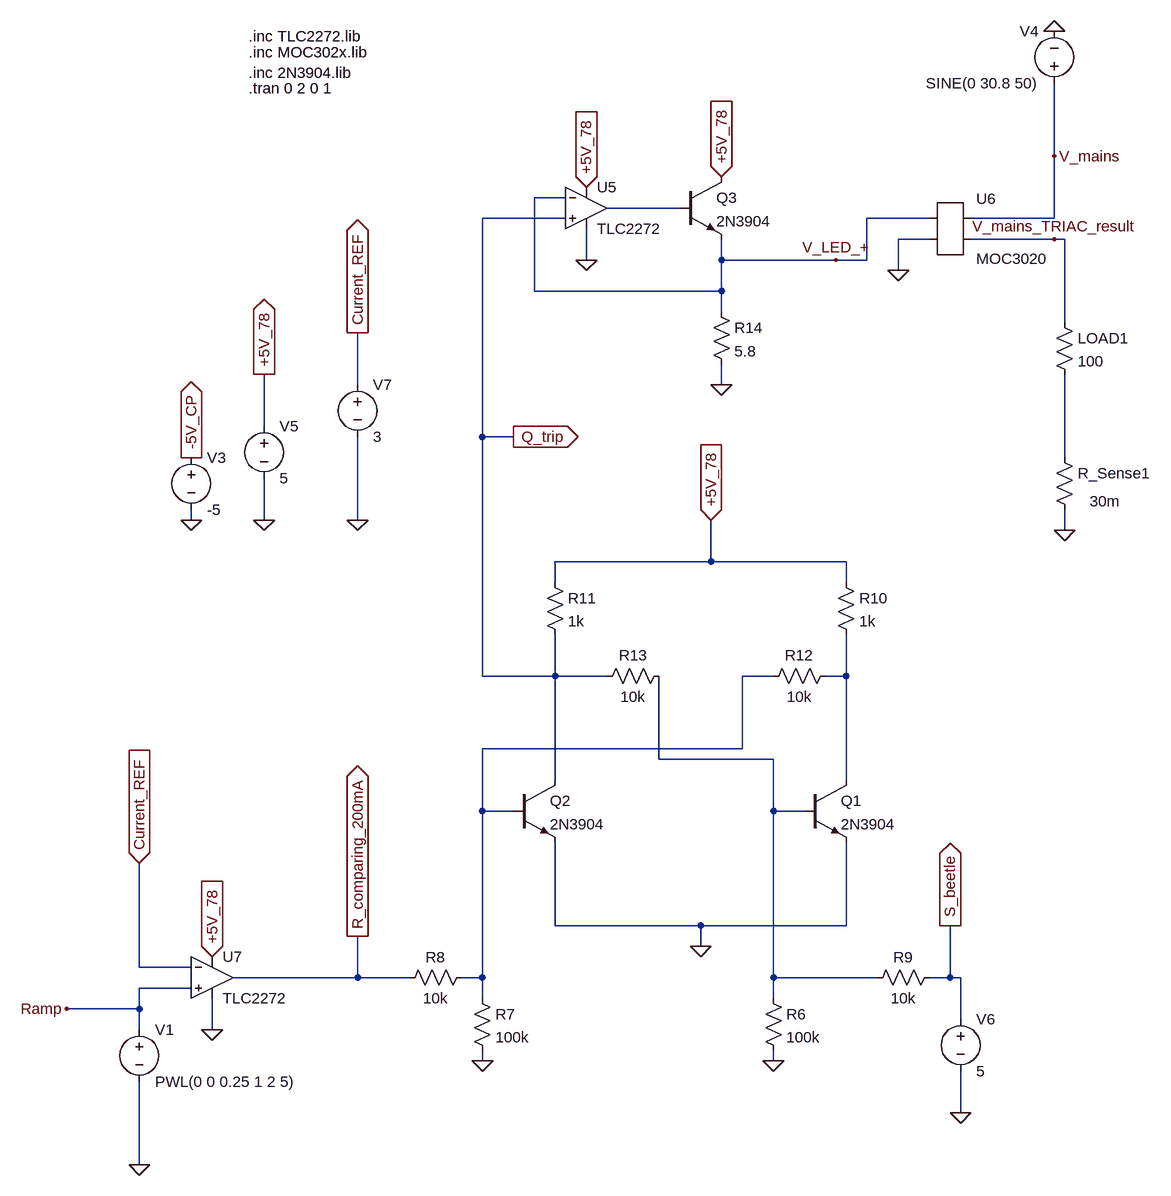
[diagram p0: schematic Dems.asc]
Dems.asc, the LTspice schematic file:
Version 4
SHEET 1 4420 4132
WIRE 1632 2560 1632 2448
WIRE 880 2624 832 2624
WIRE 1056 2640 944 2640
WIRE 880 2656 752 2656
WIRE 1440 2656 1344 2656
WIRE 1632 2656 1632 2560
WIRE 1632 2656 1504 2656
WIRE 1440 2688 1392 2688
WIRE 1632 2688 1504 2688
WIRE 1648 2688 1632 2688
WIRE 912 2720 912 2672
WIRE 1120 2720 1120 2688
WIRE 1296 2720 1120 2720
WIRE 1344 2720 1344 2656
WIRE 1344 2720 1296 2720
WIRE 1392 2736 1392 2688
WIRE 832 2768 832 2624
WIRE 1120 2768 1120 2720
WIRE 1120 2768 832 2768
WIRE 1120 2800 1120 2768
WIRE 1648 2816 1648 2688
WIRE 560 2912 560 2832
WIRE 1120 2912 1120 2880
WIRE 416 2976 416 2896
WIRE 752 2992 752 2656
WIRE 800 2992 752 2992
WIRE 1648 3024 1648 2896
WIRE 304 3120 304 3104
WIRE 416 3120 416 3056
WIRE 560 3120 560 2992
WIRE 1648 3136 1648 3104
WIRE 1104 3184 1104 3120
WIRE 1104 3184 864 3184
WIRE 1312 3184 1104 3184
WIRE 864 3216 864 3184
WIRE 1312 3216 1312 3184
WIRE 752 3360 752 2992
WIRE 864 3360 864 3296
WIRE 864 3360 752 3360
WIRE 944 3360 864 3360
WIRE 1200 3360 1152 3360
WIRE 1312 3360 1312 3296
WIRE 1312 3360 1280 3360
WIRE 1152 3472 1152 3360
WIRE 1152 3472 752 3472
WIRE 1024 3488 1024 3360
WIRE 1200 3488 1024 3488
WIRE 864 3520 864 3360
WIRE 1312 3520 1312 3360
WIRE 752 3568 752 3472
WIRE 800 3568 752 3568
WIRE 1200 3568 1200 3488
WIRE 1248 3568 1200 3568
WIRE 864 3744 864 3616
WIRE 1088 3744 864 3744
WIRE 1312 3744 1312 3616
WIRE 1312 3744 1088 3744
WIRE 1088 3776 1088 3744
WIRE 224 3808 224 3648
WIRE 304 3808 224 3808
WIRE 560 3824 560 3760
WIRE 560 3824 368 3824
WIRE 640 3824 560 3824
WIRE 752 3824 752 3568
WIRE 752 3824 720 3824
WIRE 1200 3824 1200 3568
WIRE 1360 3824 1200 3824
WIRE 1472 3824 1472 3744
WIRE 1472 3824 1440 3824
WIRE 1488 3824 1472 3824
WIRE 304 3840 224 3840
WIRE 752 3856 752 3824
WIRE 1200 3856 1200 3824
WIRE 224 3872 224 3840
WIRE 224 3872 112 3872
WIRE 1488 3888 1488 3824
WIRE 224 3904 224 3872
WIRE 336 3904 336 3856
WIRE 752 3952 752 3936
WIRE 1200 3952 1200 3936
WIRE 1488 4032 1488 3968
WIRE 224 4112 224 3984
FLAG 1648 3136 0
FLAG 304 3120 0
FLAG 304 3024 -5V_CP
IOPIN 304 3024 Out
FLAG 1632 2368 0
FLAG 1392 2736 0
FLAG 1088 3776 0
FLAG 752 3952 0
FLAG 1200 3952 0
FLAG 416 3120 0
FLAG 416 2896 +5V_78
IOPIN 416 2896 Out
FLAG 1104 3120 +5V_78
IOPIN 1104 3120 In
FLAG 1488 4032 0
FLAG 560 3760 R_comparing_200mA
IOPIN 560 3760 Out
FLAG 912 2608 +5V_78
IOPIN 912 2608 In
FLAG 912 2720 0
FLAG 1632 2560 V_mains
FLAG 1632 2688 V_mains_TRIAC_result
FLAG 1120 2592 +5V_78
IOPIN 1120 2592 In
FLAG 1120 2912 0
FLAG 560 3120 0
FLAG 560 2832 Current_REF
IOPIN 560 2832 Out
FLAG 336 3792 +5V_78
IOPIN 336 3792 In
FLAG 336 3904 0
FLAG 1296 2720 V_LED_+
FLAG 224 3648 Current_REF
IOPIN 224 3648 In
FLAG 1472 3744 S_beetle
IOPIN 1472 3744 Out
FLAG 224 4112 0
FLAG 800 2992 Q_trip
IOPIN 800 2992 Out
FLAG 112 3872 Ramp
SYMBOL res 1632 2800 R0
SYMATTR InstName LOAD1
SYMATTR Value 100
SYMBOL res 1632 3008 R0
WINDOW 3 55 83 Left 2
SYMATTR Value 30m
SYMATTR InstName R_Sense1
SYMBOL voltage 304 3008 R0
WINDOW 123 0 0 Left 2
WINDOW 39 0 0 Left 2
SYMATTR InstName V3
SYMATTR Value -5
SYMBOL voltage 1632 2464 R180
WINDOW 0 24 96 Left 2
WINDOW 3 24 16 Left 2
WINDOW 123 0 0 Left 0
WINDOW 39 0 0 Left 0
SYMATTR InstName V4
SYMATTR Value SINE(0 30.8 50)
SYMBOL npn 1248 3520 R0
SYMATTR InstName Q1
SYMATTR Value 2N3904
SYMBOL npn 800 3520 R0
SYMATTR InstName Q2
SYMATTR Value 2N3904
SYMBOL res 1184 3840 R0
SYMATTR InstName R6
SYMATTR Value 100k
SYMBOL res 736 3840 R0
SYMATTR InstName R7
SYMATTR Value 100k
SYMBOL res 736 3808 R90
WINDOW 0 0 56 VBottom 2
WINDOW 3 32 56 VTop 2
SYMATTR InstName R8
SYMATTR Value 10k
SYMBOL res 1456 3808 R90
WINDOW 0 0 56 VBottom 2
WINDOW 3 32 56 VTop 2
SYMATTR InstName R9
SYMATTR Value 10k
SYMBOL res 1296 3200 R0
SYMATTR InstName R10
SYMATTR Value 1k
SYMBOL res 848 3200 R0
SYMATTR InstName R11
SYMATTR Value 1k
SYMBOL res 1296 3344 R90
WINDOW 0 0 56 VBottom 2
WINDOW 3 32 56 VTop 2
SYMATTR InstName R12
SYMATTR Value 10k
SYMBOL res 1040 3344 R90
WINDOW 0 0 56 VBottom 2
WINDOW 3 32 56 VTop 2
SYMATTR InstName R13
SYMATTR Value 10k
SYMBOL voltage 416 2960 R0
WINDOW 123 0 0 Left 0
WINDOW 39 0 0 Left 0
SYMATTR InstName V5
SYMATTR Value 5
SYMBOL voltage 1488 3872 R0
WINDOW 123 0 0 Left 0
WINDOW 39 0 0 Left 0
SYMATTR InstName V6
SYMATTR Value 5
SYMBOL Opamps\\opamp2 912 2576 R0
SYMATTR InstName U5
SYMATTR Value TLC2272
SYMBOL npn 1056 2592 R0
SYMATTR InstName Q3
SYMATTR Value 2N3904
SYMBOL AutoGenerated\\MOC3020 1472 2672 R0
SYMATTR InstName U6
SYMBOL res 1104 2784 R0
SYMATTR InstName R14
SYMATTR Value 5.8
SYMBOL voltage 560 2896 R0
WINDOW 123 0 0 Left 0
WINDOW 39 0 0 Left 0
SYMATTR InstName V7
SYMATTR Value 3
SYMBOL Opamps\\opamp2 336 3760 R0
SYMATTR InstName U7
SYMATTR Value TLC2272
SYMBOL voltage 224 3888 R0
WINDOW 123 0 0 Left 0
WINDOW 39 0 0 Left 0
SYMATTR InstName V1
SYMATTR Value PWL(0 0 0.25 1 2 5)
TEXT 392 2400 Left 2 !.inc MOC302x.lib
TEXT 392 2432 Left 2 !.inc 2N3904.lib
TEXT 392 2456 Left 2 !.tran 0 2 0 1
TEXT 392 2376 Left 2 !.inc TLC2272.lib

The netlist it stands for:
* Dems.asc
R§LOAD1 V_mains_TRIAC_result N002 100
R_Sense1 N002 0 30m
V3 -5V_CP 0 -5
V4 V_mains 0 SINE(0 30.8 50)
Q1 N004 N005 0 0 2N3904
Q2 Q_trip N003 0 0 2N3904
R6 N005 0 100k
R7 N003 0 100k
R8 N003 R_comparing_200mA 10k
R9 S_beetle N005 10k
R10 +5V_78 N004 1k
R11 +5V_78 Q_trip 1k
R12 N004 N003 10k
R13 N005 Q_trip 10k
V5 +5V_78 0 5
V6 S_beetle 0 5
XU5 Q_trip V_LED_+ +5V_78 0 N001 TLC2272  ; pins In+ In- V+ V- OUT
Q3 +5V_78 N001 V_LED_+ 0 2N3904
* U6: MOC3020 (symbol AutoGenerated\MOC3020 not available, pins judged from their places): pin1=V_LED_+ pin2=0 pin3=V_mains pin4=V_mains_TRIAC_result
R14 V_LED_+ 0 5.8
V7 Current_REF 0 3
XU7 Ramp Current_REF +5V_78 0 R_comparing_200mA TLC2272  ; pins In+ In- V+ V- OUT
V1 Ramp 0 PWL(0 0 0.25 1 2 5)
.model NPN NPN
.model PNP PNP
.lib standard.bjt
.inc MOC302x.lib
.inc 2N3904.lib
.tran 0 2 0 1
.inc TLC2272.lib
.backanno
.end